# Altium schematic sheet MT6701CT-STD1_MT6701CT-STD.schdoc
size 124 x 99 mm
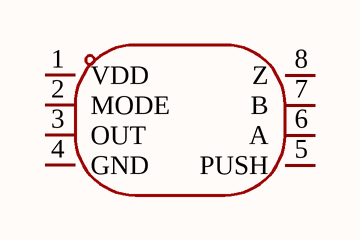
[diagram p0: MT6701CT-STD1_MT6701CT-STD.schdoc]

## Parts
U?  MT6701CT-STD  [SOP-8_L4.9-W3.9-P1.27-LS6.0-BL]  (value not drawn)

## Nets

Not connected (* = marked no-connect by the designer): U? 1(VDD) 2(MODE) 3(OUT) 4(GND) 5(PUSH) 6(A) 7(B) 8(Z)

## Library data of the parts
U? = MT6701CT-STD: Manufacturer: MagnTek(麦歌恩); Add into BOM: yes; Symbol: MT6701CT-STD; Device: MT6701CT-STD; LCSC Part Name: 霍尔在线编程角度位置传感器; Supplier Part: C2856764; Manufacturer Part: MT6701CT-STD; Supplier Footprint: SOP-8; JLCPCB Part Class: Extended Part; Datasheet: https://item.szlcsc.com/datasheet/MT6701CT-STD/3056853.html; Supplier: LCSC; Convert to PCB: yes